# EAGLE design bru-breakout (EAGLE 9.6.2)
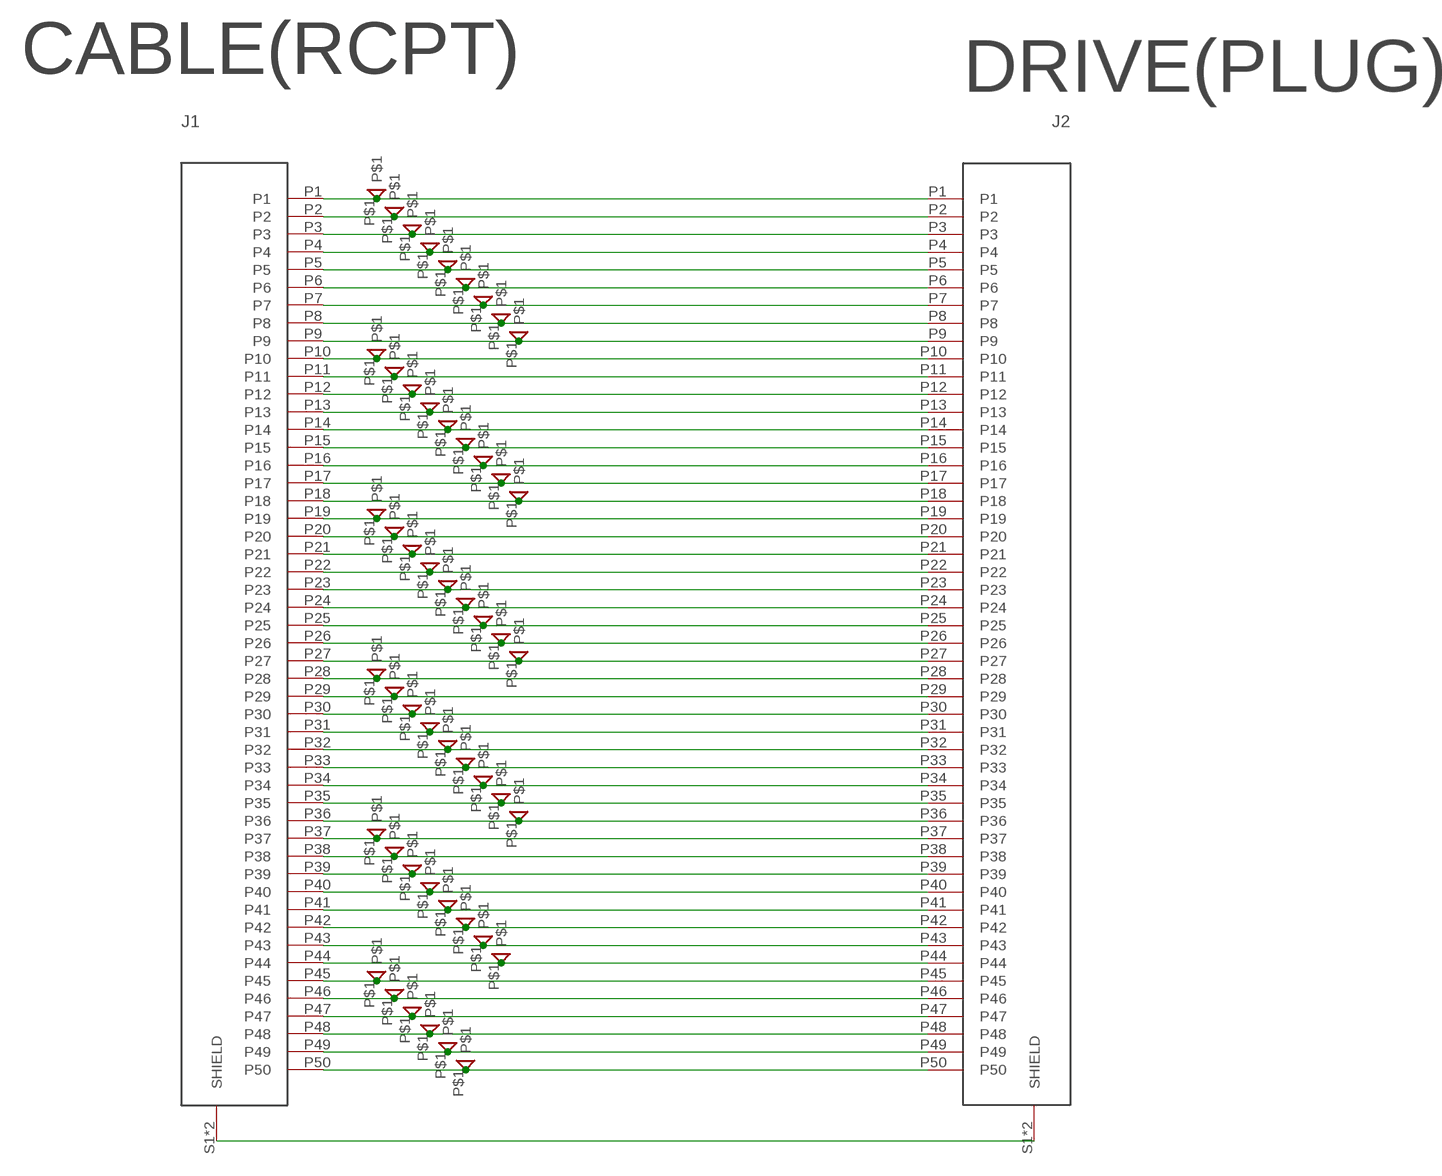
[diagram p0: schematic, sheet 1]

## Parts
J1  3M_10250-55H3PC(RECEPTACLE)  [3M_10250-55H3PC(RECEPTACLE)]
J2  3M_10150-52E2PC(PLUG)  [3M_10150-52E2PC(PLUG)]
U$1  PTH_SMALL  [PTH_SMALL]
U$2  PTH_SMALL  [PTH_SMALL]
U$3  PTH_SMALL  [PTH_SMALL]
U$4  PTH_SMALL  [PTH_SMALL]
U$5  PTH_SMALL  [PTH_SMALL]
U$6  PTH_SMALL  [PTH_SMALL]
U$7  PTH_SMALL  [PTH_SMALL]
U$8  PTH_SMALL  [PTH_SMALL]
U$9  PTH_SMALL  [PTH_SMALL]
U$10  PTH_SMALL  [PTH_SMALL]
U$11  PTH_SMALL  [PTH_SMALL]
U$12  PTH_SMALL  [PTH_SMALL]
U$13  PTH_SMALL  [PTH_SMALL]
U$14  PTH_SMALL  [PTH_SMALL]
U$15  PTH_SMALL  [PTH_SMALL]
U$16  PTH_SMALL  [PTH_SMALL]
U$17  PTH_SMALL  [PTH_SMALL]
U$18  PTH_SMALL  [PTH_SMALL]
U$19  PTH_SMALL  [PTH_SMALL]
U$20  PTH_SMALL  [PTH_SMALL]
U$21  PTH_SMALL  [PTH_SMALL]
U$22  PTH_SMALL  [PTH_SMALL]
U$23  PTH_SMALL  [PTH_SMALL]
U$24  PTH_SMALL  [PTH_SMALL]
U$25  PTH_SMALL  [PTH_SMALL]
U$26  PTH_SMALL  [PTH_SMALL]
U$27  PTH_SMALL  [PTH_SMALL]
U$28  PTH_SMALL  [PTH_SMALL]
U$29  PTH_SMALL  [PTH_SMALL]
U$30  PTH_SMALL  [PTH_SMALL]
U$31  PTH_SMALL  [PTH_SMALL]
U$32  PTH_SMALL  [PTH_SMALL]
U$33  PTH_SMALL  [PTH_SMALL]
U$34  PTH_SMALL  [PTH_SMALL]
U$35  PTH_SMALL  [PTH_SMALL]
U$36  PTH_SMALL  [PTH_SMALL]
U$37  PTH_SMALL  [PTH_SMALL]
U$38  PTH_SMALL  [PTH_SMALL]
U$39  PTH_SMALL  [PTH_SMALL]
U$40  PTH_SMALL  [PTH_SMALL]
U$41  PTH_SMALL  [PTH_SMALL]
U$42  PTH_SMALL  [PTH_SMALL]
U$43  PTH_SMALL  [PTH_SMALL]
U$44  PTH_SMALL  [PTH_SMALL]
U$45  PTH_SMALL  [PTH_SMALL]
U$46  PTH_SMALL  [PTH_SMALL]
U$47  PTH_SMALL  [PTH_SMALL]
U$48  PTH_SMALL  [PTH_SMALL]
U$49  PTH_SMALL  [PTH_SMALL]
U$50  PTH_SMALL  [PTH_SMALL]

## Nets
N$1: J1.P1 J2.P1 U$1.P$1
N$2: J1.P2 J2.P2 U$2.P$1
N$3: J1.P3 J2.P3 U$3.P$1
N$4: J1.P4 J2.P4 U$4.P$1
N$5: J1.P5 J2.P5 U$5.P$1
N$6: J1.P6 J2.P6 U$6.P$1
N$7: J1.P7 J2.P7 U$7.P$1
N$8: J1.P8 J2.P8 U$8.P$1
N$9: J1.P9 J2.P9 U$9.P$1
N$10: J1.P10 J2.P10 U$10.P$1
N$11: J1.P11 J2.P11 U$11.P$1
N$12: J1.P12 J2.P12 U$12.P$1
N$13: J1.P13 J2.P13 U$13.P$1
N$14: J1.P14 J2.P14 U$14.P$1
N$15: J1.P15 J2.P15 U$15.P$1
N$16: J1.P16 J2.P16 U$16.P$1
N$17: J1.P17 J2.P17 U$17.P$1
N$18: J1.P18 J2.P18 U$18.P$1
N$19: J1.P19 J2.P19 U$19.P$1
N$20: J1.P20 J2.P20 U$20.P$1
N$21: J1.P21 J2.P21 U$21.P$1
N$22: J1.P22 J2.P22 U$22.P$1
N$23: J1.P23 J2.P23 U$23.P$1
N$24: J1.P24 J2.P24 U$24.P$1
N$25: J1.P25 J2.P25 U$25.P$1
N$26: J1.P26 J2.P26 U$26.P$1
N$27: J1.P27 J2.P27 U$27.P$1
N$28: J1.P28 J2.P28 U$28.P$1
N$29: J1.P29 J2.P29 U$29.P$1
N$30: J1.P30 J2.P30 U$30.P$1
N$31: J1.P31 J2.P31 U$31.P$1
N$32: J1.P32 J2.P32 U$32.P$1
N$33: J1.P33 J2.P33 U$33.P$1
N$34: J1.P34 J2.P34 U$34.P$1
N$35: J1.P35 J2.P35 U$35.P$1
N$36: J1.P36 J2.P36 U$36.P$1
N$37: J1.P37 J2.P37 U$37.P$1
N$38: J1.P38 J2.P38 U$38.P$1
N$39: J1.P39 J2.P39 U$39.P$1
N$40: J1.P40 J2.P40 U$40.P$1
N$41: J1.P41 J2.P41 U$41.P$1
N$42: J1.P42 J2.P42 U$42.P$1
N$43: J1.P43 J2.P43 U$43.P$1
N$44: J1.P44 J2.P44 U$44.P$1
N$45: J1.P45 J2.P45 U$45.P$1
N$46: J1.P46 J2.P46 U$46.P$1
N$47: J1.P47 J2.P47 U$47.P$1
N$48: J1.P48 J2.P48 U$48.P$1
N$49: J1.P49 J2.P49 U$49.P$1
N$50: J1.P50 J2.P50 U$50.P$1
SHIELD: J1.S1(SHIELD) J1.S2(SHIELD) J2.S1(SHIELD) J2.S2(SHIELD)

## Notes on the sheet
- CABLE(RCPT) | DRIVE(PLUG)

## Library data of the parts
J1 = mini-d-sub:3M_10250-55H3PC(RECEPTACLE)
J2 = mini-d-sub:3M_10150-52E2PC(PLUG)
U$1-U$50 = testpoint:PTH_SMALL

## Board
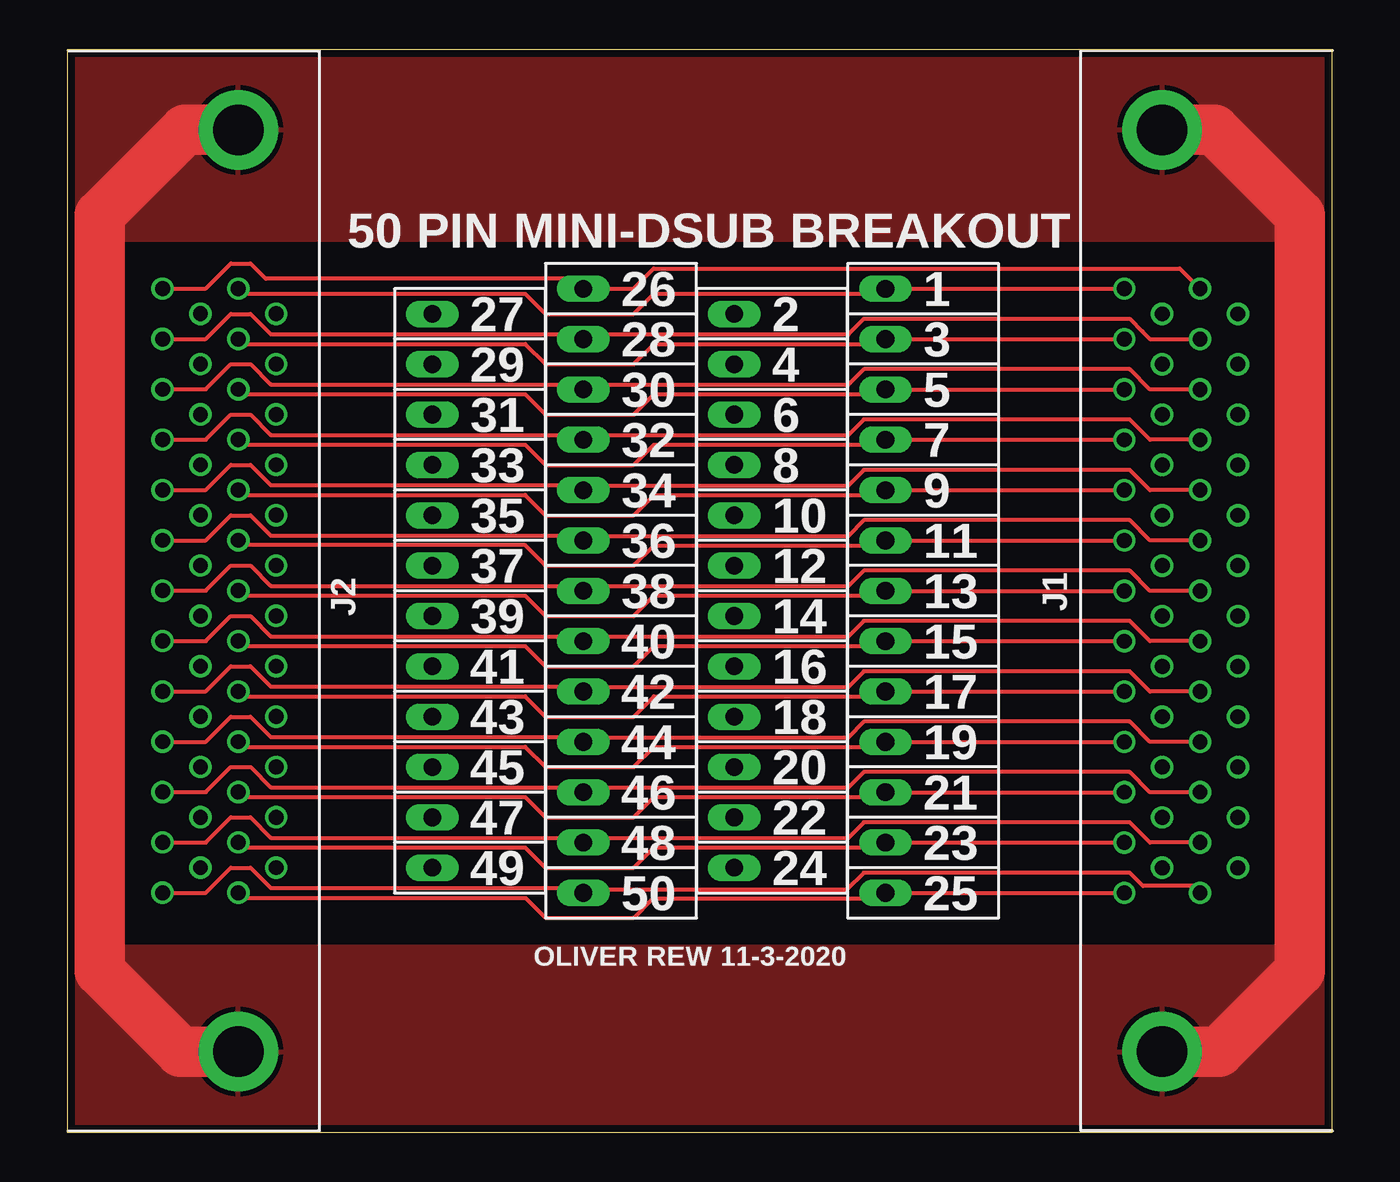
[diagram p1: board, top side]
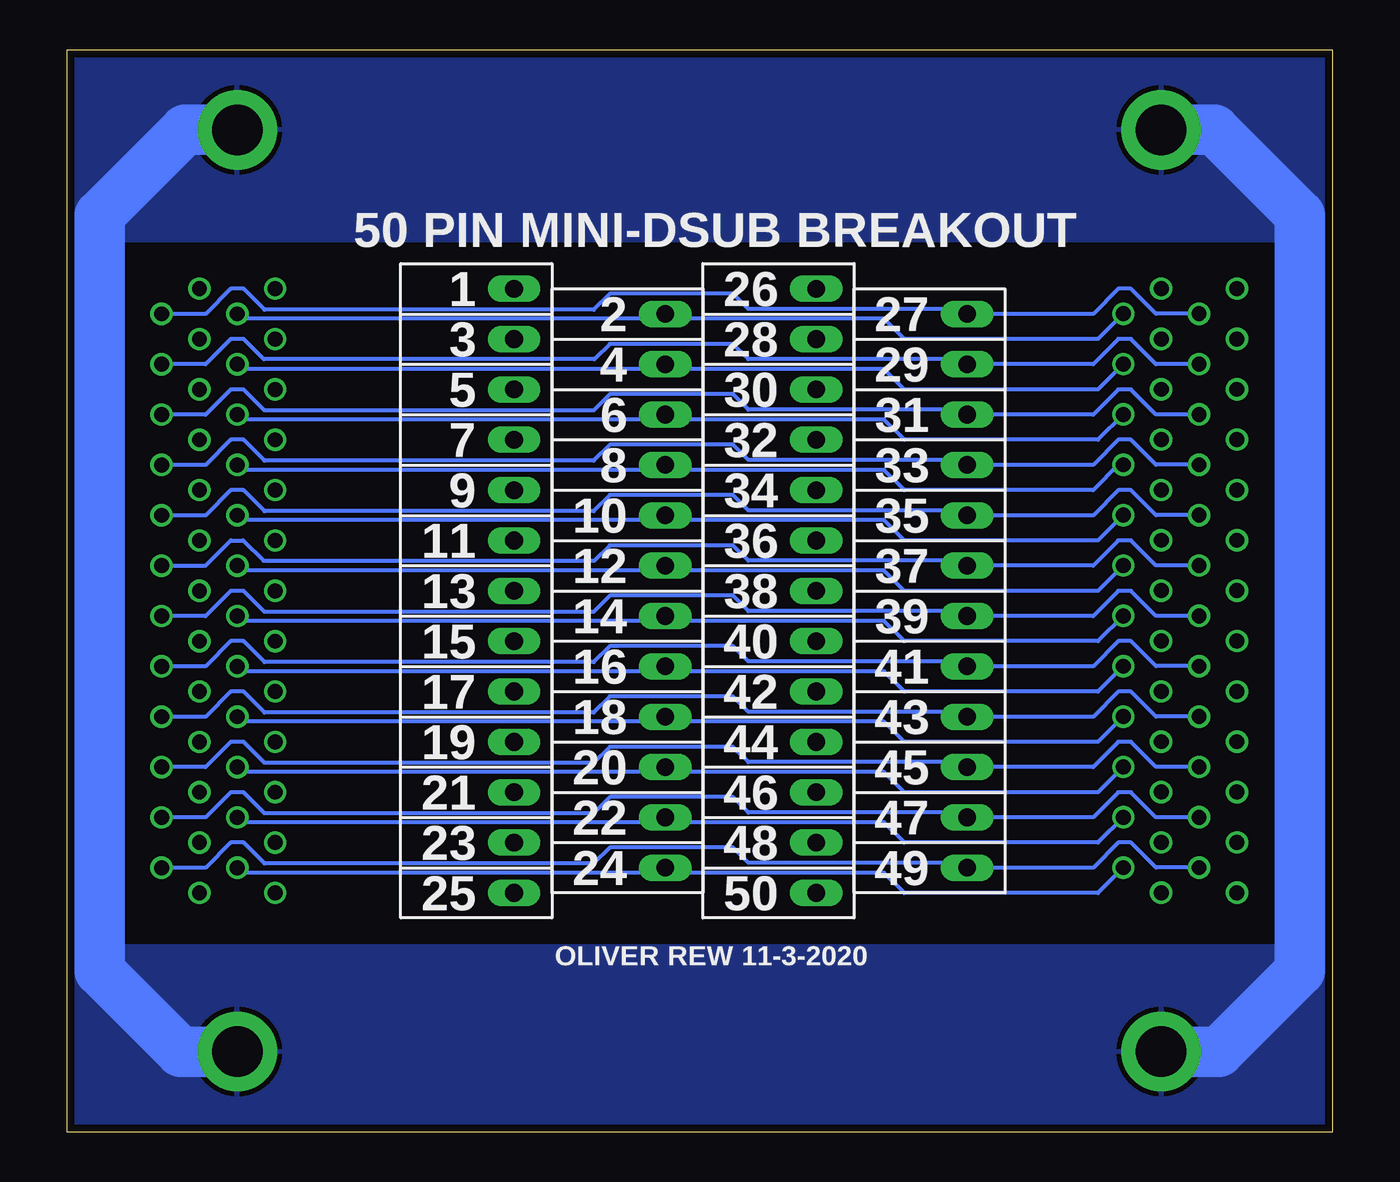
[diagram p2: board, bottom side, seen from below]

Size 63.82 x 54.61 mm. Coordinates in mm from the lower left corner, seen from the top.
Outline: 63.82,54.61 0,54.61 0,0 63.82,0 63.82,54.61
Copper layers (1*16): Top 0.035559375mm / dielectric 1.6mm / Bottom 0.035559375mm
Design rules "oshpark-2layer *": minimum track width 6mil, minimum drill 10mil, track to track 10mil, track to pad 10mil, pad to pad 10mil, via to via 10mil, smd to smd 6mil, copper to edge 15mil, drill to drill 6mil, minimum pad ring 5mil, minimum via ring 5mil, stop-mask expansion 2.5mil, vias tented up to drill 0mil, thermal gap 10mil

### Footprints (pad centres in the part's own frame; a part is rotated, then mirrored left to right if it is on the bottom)
3M_10250-55H3PC(RECEPTACLE) = drill 0.75: P1 15.24,5.73; P2 13.97,3.82; P3 12.7,5.73; P4 11.43,3.82; P5 10.16,5.73; P6 8.89,3.82; P7 7.62,5.73; P8 6.35,3.82; P9 5.08,5.73; P10 3.81,3.82; P11 2.54,5.73; P12 1.27,3.82; P13 0,5.73; P14 -1.27,3.82; P15 -2.54,5.73; P16 -3.81,3.82; P17 -5.08,5.73; P18 -6.35,3.82; P19 -7.62,5.73; P20 -8.89,3.82; P21 -10.16,5.73; P22 -11.43,3.82; P23 -12.7,5.73; P24 -13.97,3.82; P25 -15.24,5.73; P26 15.24,1.91; P27 13.97,0; P28 12.7,1.91; P29 11.43,0; P30 10.16,1.91; P31 8.89,0; P32 7.62,1.91; P33 6.35,0; P34 5.08,1.91; P35 3.81,0; P36 2.54,1.91; P37 1.27,0; P38 0,1.91; P39 -1.27,0; P40 -2.54,1.91; P41 -3.81,0; P42 -5.08,1.91; P43 -6.35,0; P44 -7.62,1.91; P45 -8.89,0; P46 -10.16,1.91; P47 -11.43,0; P48 -12.7,1.91; P49 -13.97,0; P50 -15.24,1.91 | drill 2.54 pad 4: S1 -23.25,3.82; S2 23.25,3.82
3M_10150-52E2PC(PLUG) = drill 0.75: P1 -15.24,3.82; P2 -13.97,5.73; P3 -12.7,3.82; P4 -11.43,5.73; P5 -10.16,3.82; P6 -8.89,5.73; P7 -7.62,3.82; P8 -6.35,5.73; P9 -5.08,3.82; P10 -3.81,5.73; P11 -2.54,3.82; P12 -1.27,5.73; P13 0,3.82; P14 1.27,5.73; P15 2.54,3.82; P16 3.81,5.73; P17 5.08,3.82; P18 6.35,5.73; P19 7.62,3.82; P20 8.89,5.73; P21 10.16,3.82; P22 11.43,5.73; P23 12.7,3.82; P24 13.97,5.73; P25 15.24,3.82; P26 -15.24,0; P27 -13.97,1.91; P28 -12.7,0; P29 -11.43,1.91; P30 -10.16,0; P31 -8.89,1.91; P32 -7.62,0; P33 -6.35,1.91; P34 -5.08,0; P35 -3.81,1.91; P36 -2.54,0; P37 -1.27,1.91; P38 0,0; P39 1.27,1.91; P40 2.54,0; P41 3.81,1.91; P42 5.08,0; P43 6.35,1.91; P44 7.62,0; P45 8.89,1.91; P46 10.16,0; P47 11.43,1.91; P48 12.7,0; P49 13.97,1.91; P50 15.24,0 | drill 2.54 pad 4: S1 -23.25,3.82; S2 23.25,3.82
PTH_SMALL = drill 0.889 long: P$1 0,0

### Placement (x,y rotation side)
J1  59.05,27.3 90 top
J2  4.81,27.31 270 top
U$1  41.27,42.55 180 top
U$2  33.66,41.27 180 top
U$3  41.27,40.01 180 top
U$4  33.66,38.73 180 top
U$5  41.27,37.47 180 top
U$6  33.66,36.2 180 top
U$7  41.27,34.92 180 top
U$8  33.66,33.66 180 top
U$9  41.27,32.38 180 top
U$10  33.66,31.11 180 top
U$11  41.27,29.84 180 top
U$12  33.66,28.57 180 top
U$13  41.27,27.3 180 top
U$14  33.66,26.04 180 top
U$15  41.27,24.77 180 top
U$16  33.66,23.5 180 top
U$17  41.27,22.23 180 top
U$18  33.66,20.95 180 top
U$19  41.27,19.68 180 top
U$20  33.66,18.41 180 top
U$21  41.27,17.14 180 top
U$22  33.66,15.88 180 top
U$23  41.27,14.61 180 top
U$24  33.66,13.34 180 top
U$25  41.27,12.06 180 top
U$26  26.04,42.55 180 top
U$27  18.41,41.27 180 top
U$28  26.04,40.01 180 top
U$29  18.41,38.73 180 top
U$30  26.04,37.47 180 top
U$31  18.41,36.2 180 top
U$32  26.04,34.92 180 top
U$33  18.41,33.66 180 top
U$34  26.04,32.38 180 top
U$35  18.41,31.11 180 top
U$36  26.04,29.84 180 top
U$37  18.41,28.57 180 top
U$38  26.04,27.3 180 top
U$39  18.41,26.04 180 top
U$40  26.04,24.77 180 top
U$41  18.41,23.5 180 top
U$42  26.04,22.23 180 top
U$43  18.41,20.95 180 top
U$44  26.04,19.68 180 top
U$45  18.41,18.41 180 top
U$46  26.04,17.14 180 top
U$47  18.41,15.88 180 top
U$48  26.04,14.61 180 top
U$49  18.41,13.34 180 top
U$50  26.04,12.06 180 top

### Tracks (layer width: path | path; a pad name or v marks a point on that pad's centre or on a via)
N$1
  Top 0.203: J2.P1 8.89,42.3 23.11,42.3 24.13,41.27 28.57,41.27 29.6,42.3 41.03,42.3 U$1.P$1 J1.P1
N$2
  Bottom 0.203: J2.P2 11.82,40.01 21.59,40.01 22.61,41.03 33.41,41.03 U$2.P$1 33.9,41.03 54.99,41.03 J1.P2
N$3
  Top 0.203: J2.P3 8.89,39.76 23.11,39.76 24.13,38.73 28.57,38.73 29.6,39.76 41.03,39.76 U$3.P$1 J1.P3
N$4
  Bottom 0.203: J2.P4 11.82,37.47 21.59,37.47 22.61,38.49 33.41,38.49 U$4.P$1 33.9,38.49 54.99,38.49 J1.P4
N$5
  Top 0.203: J2.P5 8.89,37.22 23.11,37.22 24.13,36.2 28.57,36.2 29.6,37.22 41.03,37.22 U$5.P$1 J1.P5
N$6
  Bottom 0.203: J2.P6 11.82,34.92 21.59,34.92 22.61,35.95 33.41,35.95 U$6.P$1 33.9,35.95 54.99,35.95 J1.P6
N$7
  Top 0.203: J2.P7 8.89,34.68 23.11,34.68 24.13,33.66 28.57,33.66 29.6,34.68 41.03,34.68 U$7.P$1 J1.P7
N$8
  Bottom 0.203: J2.P8 10.79,33.66 12.06,32.38 21.59,32.38 22.61,33.41 33.41,33.41 U$8.P$1 33.9,33.41 54.99,33.41 J1.P8
N$9
  Top 0.203: J2.P9 8.89,32.14 23.11,32.14 24.13,31.11 28.57,31.11 29.6,32.14 41.03,32.14 U$9.P$1 J1.P9
N$10
  Bottom 0.203: J2.P10 11.82,29.84 21.59,29.84 22.61,30.87 33.41,30.87 U$10.P$1 33.9,30.87 54.99,30.87 J1.P10
N$11
  Top 0.203: J2.P11 8.85,29.64 23.07,29.64 24.13,28.57 28.57,28.57 29.6,29.6 41.03,29.6 U$11.P$1 J1.P11
N$12
  Bottom 0.203: J2.P12 11.82,27.3 21.59,27.3 22.61,28.33 33.41,28.33 U$12.P$1 33.9,28.33 54.99,28.33 J1.P12
N$13
  Top 0.203: J2.P13 8.89,27.06 23.11,27.06 24.13,26.04 28.57,26.04 29.6,27.06 41.03,27.06 U$13.P$1 J1.P13
N$14
  Bottom 0.203: J2.P14 11.82,24.77 21.59,24.77 22.61,25.79 33.41,25.79 U$14.P$1 33.9,25.79 54.99,25.79 J1.P14
N$15
  Top 0.203: J2.P15 8.89,24.52 23.11,24.52 24.13,23.5 28.57,23.5 29.6,24.52 41.03,24.52 U$15.P$1 J1.P15
N$16
  Bottom 0.203: J2.P16 11.82,22.23 21.59,22.23 22.61,23.25 33.41,23.25 U$16.P$1 33.9,23.25 54.99,23.25 J1.P16
N$17
  Top 0.203: J2.P17 8.89,21.98 23.11,21.98 24.13,20.95 28.57,20.95 29.6,21.98 41.03,21.98 U$17.P$1 J1.P17
N$18
  Bottom 0.203: J2.P18 11.82,19.68 21.59,19.68 22.61,20.71 33.41,20.71 U$18.P$1 33.9,20.71 54.99,20.71 J1.P18
N$19
  Top 0.203: J2.P19 8.89,19.44 23.11,19.44 24.13,18.41 28.57,18.41 29.6,19.44 41.03,19.44 U$19.P$1 J1.P19
N$20
  Bottom 0.203: J2.P20 11.82,17.14 21.59,17.14 22.61,18.17 33.41,18.17 U$20.P$1 33.9,18.17 54.99,18.17 J1.P20
N$21
  Top 0.203: J2.P21 8.89,16.9 23.11,16.9 24.13,15.88 28.57,15.88 29.6,16.9 41.03,16.9 U$21.P$1 J1.P21
N$22
  Bottom 0.203: J2.P22 11.82,14.61 21.59,14.61 22.61,15.63 33.41,15.63 U$22.P$1 33.9,15.63 54.99,15.63 J1.P22
N$23
  Top 0.203: J2.P23 8.89,14.36 23.11,14.36 24.13,13.34 28.57,13.34 29.6,14.36 41.03,14.36 U$23.P$1 J1.P23
N$24
  Bottom 0.203: J2.P24 11.82,12.06 21.59,12.06 22.61,13.09 33.41,13.09 U$24.P$1 33.9,13.09 54.99,13.09 J1.P24
N$25
  Top 0.203: J2.P25 8.89,11.81 23.12,11.81 24.12,10.81 28.59,10.81 29.53,11.75 40.96,11.75 U$25.P$1 J1.P25
N$26
  Top 0.203: J2.P26 6.99,42.55 8.26,43.81 9.25,43.81 10.02,43.05 25.54,43.05 U$26.P$1 28.56,42.55 29.59,43.57 56.12,43.57 J1.P26
N$27
  Bottom 0.203: J2.P27 8.9,41.28 10.16,42.55 10.79,42.55 12.06,41.27 U$27.P$1 18.66,41.52 29.46,41.52 30.23,42.3 36.44,42.3 37.26,41.48 53.87,41.48 54.93,42.55 55.56,42.55 56.83,41.27 J1.P27
N$28
  Top 0.203: J2.P28 6.99,40.01 8.26,41.27 9.25,41.27 10.27,40.25 25.79,40.25 U$28.P$1 26.28,40.25 39.41,40.25 40.19,41.03 53.6,41.03 54.24,40.38 54.24,40.37 54.61,40.01 J1.P28
N$29
  Bottom 0.203: J2.P29 8.9,38.74 10.16,40.01 10.79,40.01 12.06,38.73 U$29.P$1 18.66,38.98 29.46,38.98 30.23,39.76 36.44,39.76 37.22,38.98 53.91,38.98 54.93,40.01 55.56,40.01 56.83,38.73 J1.P29
N$30
  Top 0.203: J2.P30 6.99,37.47 8.26,38.73 9.25,38.73 10.27,37.71 25.79,37.71 U$30.P$1 26.25,37.67 39.37,37.67 40.19,38.49 53.6,38.49 54.62,37.47 J1.P30
N$31
  Bottom 0.203: J2.P31 8.9,36.2 10.16,37.47 10.79,37.47 12.06,36.2 U$31.P$1 18.66,36.44 29.46,36.44 30.23,37.22 36.44,37.22 37.26,36.41 53.87,36.41 54.93,37.47 55.56,37.47 56.83,36.2 J1.P31
N$32
  Top 0.203: J2.P32 6.99,34.93 8.26,36.2 9.25,36.2 10.27,35.17 25.79,35.17 U$32.P$1 26.25,35.13 39.37,35.13 40.19,35.95 53.6,35.95 54.62,34.92 J1.P32
N$33
  Bottom 0.203: J2.P33 8.9,33.66 10.16,34.92 10.79,34.92 12.06,33.66 U$33.P$1 18.66,33.9 29.46,33.9 30.23,34.68 36.44,34.68 37.26,33.87 53.87,33.87 54.93,34.92 55.56,34.92 56.83,33.66 J1.P33
N$34
  Top 0.203: J2.P34 6.99,32.39 8.26,33.66 9.25,33.66 10.27,32.63 25.79,32.63 25.96,32.46 | 25.96,32.46 U$34.P$1 | J1.P34 54.62,32.38 53.6,33.41 40.19,33.41 39.37,32.59 26.09,32.59 25.96,32.46
N$35
  Bottom 0.203: J2.P35 8.9,31.12 10.16,32.38 10.79,32.38 12.06,31.11 U$35.P$1 18.66,31.36 29.46,31.36 30.23,32.14 36.44,32.14 37.26,31.32 53.87,31.32 54.93,32.38 55.56,32.38 56.83,31.11 J1.P35
N$36
  Top 0.203: J2.P36 6.99,29.85 8.26,31.11 9.25,31.11 10.27,30.09 25.79,30.09 U$36.P$1 26.25,30.05 39.37,30.05 40.19,30.87 53.6,30.87 54.62,29.84 J1.P36
N$37
  Bottom 0.203: J2.P37 8.9,28.58 10.16,29.84 10.79,29.84 12.06,28.57 U$37.P$1 18.66,28.82 29.46,28.82 30.23,29.6 36.44,29.6 37.22,28.82 53.92,28.82 54.94,29.84 55.56,29.84 56.83,28.57 J1.P37
N$38
  Top 0.203: J2.P38 6.99,27.31 8.26,28.57 9.25,28.57 10.27,27.55 25.79,27.55 U$38.P$1 26.25,27.52 39.37,27.52 40.19,28.33 53.6,28.33 54.62,27.3 J1.P38
N$39
  Bottom 0.203: J2.P39 8.9,26.04 10.16,27.3 10.79,27.3 12.06,26.04 U$39.P$1 18.66,26.28 29.46,26.28 30.23,27.06 36.44,27.06 37.26,26.25 53.87,26.25 54.93,27.3 55.56,27.3 56.83,26.04 J1.P39
N$40
  Top 0.203: J2.P40 6.99,24.77 8.26,26.04 9.25,26.04 10.27,25.01 25.79,25.01 U$40.P$1 26.25,24.98 39.37,24.98 40.19,25.79 53.6,25.79 54.62,24.77 J1.P40
N$41
  Bottom 0.203: J2.P41 8.9,23.5 10.16,24.77 10.79,24.77 12.06,23.5 U$41.P$1 18.66,23.74 29.46,23.74 30.23,24.52 36.44,24.52 37.26,23.7 53.87,23.7 54.93,24.77 55.56,24.77 56.83,23.5 J1.P41
N$42
  Top 0.203: J2.P42 6.99,22.23 8.26,23.5 9.25,23.5 10.27,22.47 25.79,22.47 U$42.P$1 26.25,22.43 39.37,22.43 40.19,23.25 53.6,23.25 54.62,22.23 J1.P42
N$43
  Bottom 0.203: J2.P43 8.9,20.96 10.16,22.23 10.79,22.23 12.06,20.95 U$43.P$1 18.66,21.2 29.46,21.2 30.23,21.98 36.44,21.98 37.26,21.16 53.87,21.16 54.93,22.23 55.56,22.23 56.83,20.95 J1.P43
N$44
  Top 0.203: J2.P44 6.99,19.69 8.26,20.95 9.25,20.95 10.27,19.93 25.79,19.93 U$44.P$1 26.25,19.89 39.37,19.89 40.19,20.71 53.6,20.71 54.62,19.68 J1.P44
N$45
  Bottom 0.203: J2.P45 8.9,18.42 10.16,19.68 10.79,19.68 12.06,18.41 U$45.P$1 18.66,18.66 29.46,18.66 30.23,19.44 36.44,19.44 37.26,18.62 53.87,18.62 54.93,19.68 55.56,19.68 56.83,18.41 J1.P45
N$46
  Top 0.203: J2.P46 6.99,17.15 8.26,18.41 9.25,18.41 10.27,17.39 25.79,17.39 U$46.P$1 26.25,17.36 39.37,17.36 40.19,18.17 53.6,18.17 54.62,17.14 J1.P46
N$47
  Bottom 0.203: J2.P47 8.9,15.88 10.16,17.14 10.79,17.14 12.06,15.88 U$47.P$1 18.66,16.12 29.46,16.12 30.23,16.9 36.44,16.9 37.26,16.09 53.87,16.09 54.93,17.14 55.56,17.14 56.83,15.88 J1.P47
N$48
  Top 0.203: J2.P48 6.99,14.61 8.26,15.88 9.25,15.88 10.27,14.85 25.79,14.85 U$48.P$1 26.25,14.81 39.37,14.81 40.19,15.63 53.6,15.63 54.62,14.61 J1.P48
N$49
  Bottom 0.203: J2.P49 8.9,13.34 10.16,14.61 10.79,14.61 12.06,13.34 U$49.P$1 18.66,13.58 29.46,13.58 30.23,14.36 36.44,14.36 37.26,13.54 53.87,13.54 54.93,14.61 55.56,14.61 56.83,13.34 J1.P49
N$50
  Top 0.203: J2.P50 6.99,12.07 8.26,13.34 9.25,13.34 10.27,12.31 25.79,12.31 U$50.P$1 26.18,12.21 39.31,12.21 40.19,13.09 53.6,13.09 54.27,12.42 56.79,12.42 J1.P50
SHIELD
  Top 2.54: J2.S2 5.71,4.06 1.65,8.12 1.65,46.25 5.96,50.56 J2.S1 | J1.S2 57.86,50.55 62.17,46.25 62.17,8.12 58.1,4.05 J1.S1
  Bottom 2.54: J1.S1 58.1,4.05 62.17,8.12 62.17,46.25 57.86,50.55 J1.S2 | J2.S2 5.71,4.06 1.65,8.12 1.65,46.25 5.96,50.56 J2.S1
  pour Top: -1.25,9.38 65,9.38 65,-1.25 -1.25,-1.25
  pour Top: -1.25,55.62 65,55.62 65,45 -1.25,45
  pour Bottom: -1.25,55.62 65,55.62 65,45 -1.25,45
  pour Bottom: -1.25,9.38 65,9.38 65,-1.25 -1.25,-1.25

### Text on the board
tPlace: 50 PIN MINI-DSUB BREAKOUT | 26 | 1 | 27 | 2 | 28 | 3 | 29 | 4 | 30 | 5 | 31 | 6 | 32 | 7 | 33 | 8 | 34 | 9 | 35 | 10 | 36 | 11 | 37 | 12 | 38 | 13 | 39 | 14 | 40 | 15 | 41 | 16 | 42 | 17 | 43 | 18 | 44 | 19 | 45 | 20 | 46 | 21 | 47 | 22 | 48 | 23 | 49 | 24 | 50 | 25 | OLIVER REW 11-3-2020
bPlace: 50 PIN MINI-DSUB BREAKOUT | 26 | 1 | 27 | 2 | 28 | 3 | 29 | 4 | 30 | 5 | 31 | 6 | 32 | 7 | 33 | 8 | 34 | 9 | 35 | 10 | 36 | 11 | 37 | 12 | 38 | 13 | 39 | 14 | 40 | 15 | 41 | 16 | 42 | 17 | 43 | 18 | 44 | 19 | 45 | 20 | 46 | 21 | 47 | 22 | 48 | 23 | 49 | 24 | 50 | 25 | OLIVER REW 11-3-2020
Document: DRIVE(PLUG) | CABLE(RECEPTACLE)